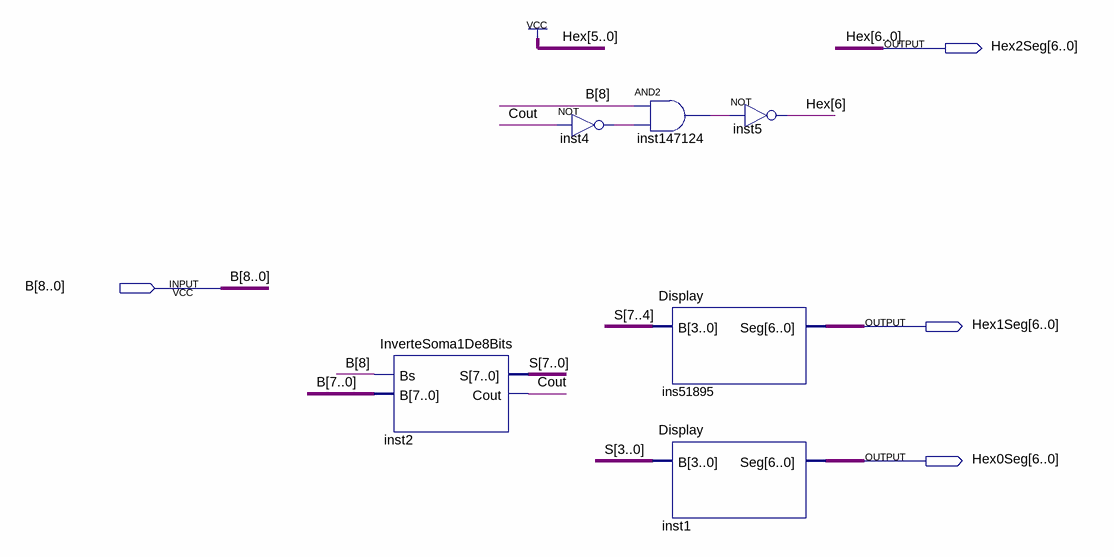
[diagram p0: schematic sheet]
// Quartus schematic 2DigitDisplayWithSignal.bdf as structural Verilog: 6 symbols, 4 pins
module \2DigitDisplayWithSignal  (
  input  [8:0] B,
  output [6:0] Hex2Seg,
  output [6:0] Hex1Seg,
  output [6:0] Hex0Seg
);

  wire Cout, inst4_out, inst147124_out;
  wire [7:0] S;

  InverteSoma1De8Bits inst2 (.B(B[7:0]), .Bs(B[8]), .S(S), .Cout(Cout));
  not inst4 (inst4_out, Cout);
  and inst147124 (inst147124_out, B[8], inst4_out);
  Display ins51895 (.B(S[7:4]), .Seg(Hex1Seg));
  Display inst1 (.B(S[3:0]), .Seg(Hex0Seg));
  not inst5 (Hex2Seg[6], inst147124_out);

  assign Hex2Seg[5:0] = {6{1'b1}};

  // Other names for the same wires on the sheet: Hex[6] = Hex2Seg[6]
endmodule
